# Altium schematic sheet DDS.SchDoc
size A2
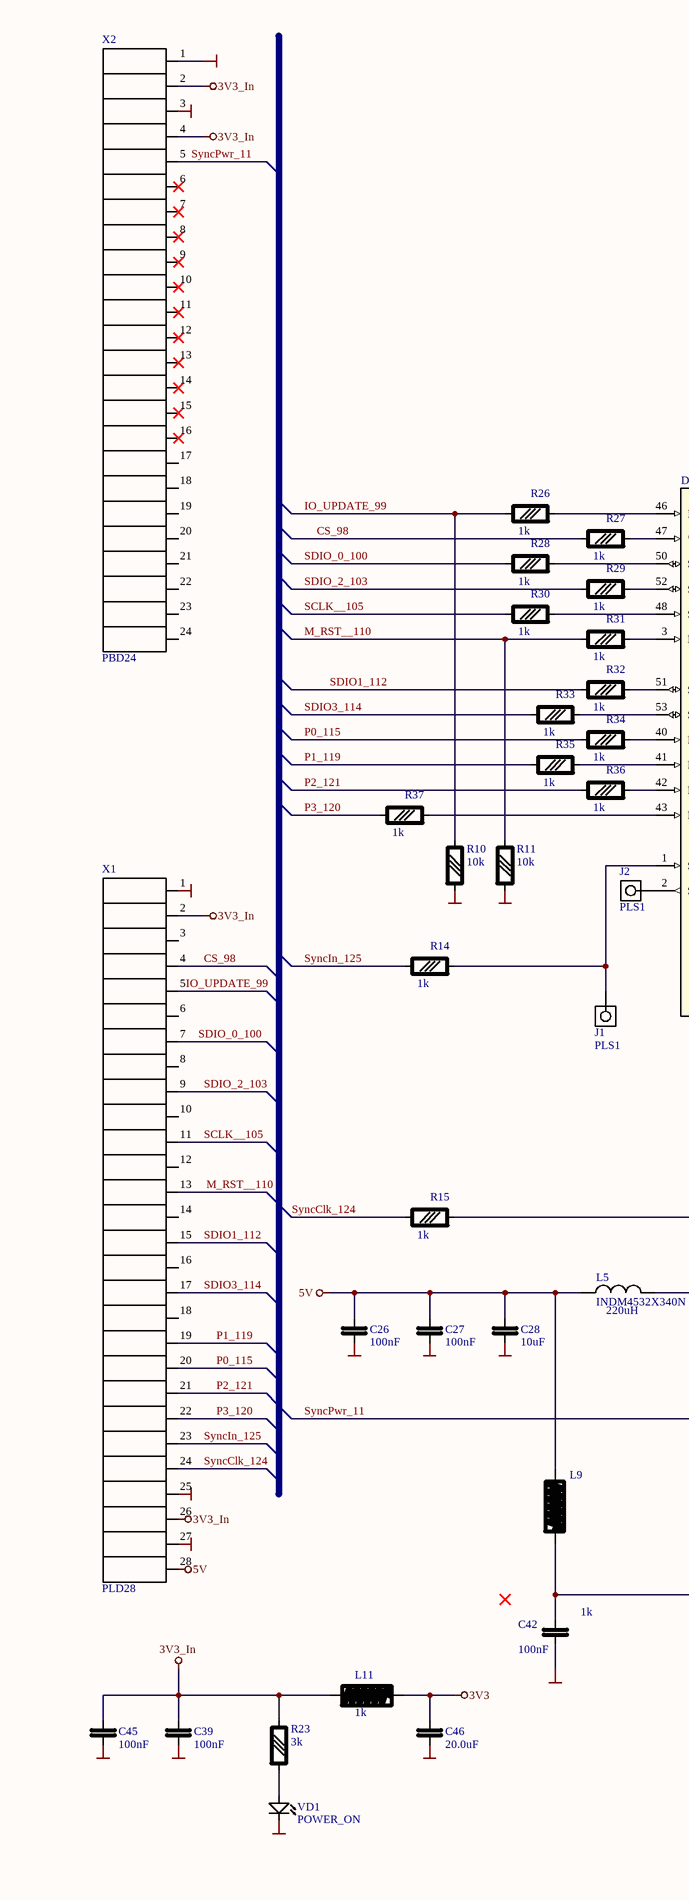
[diagram p0: DDS.SchDoc, left]
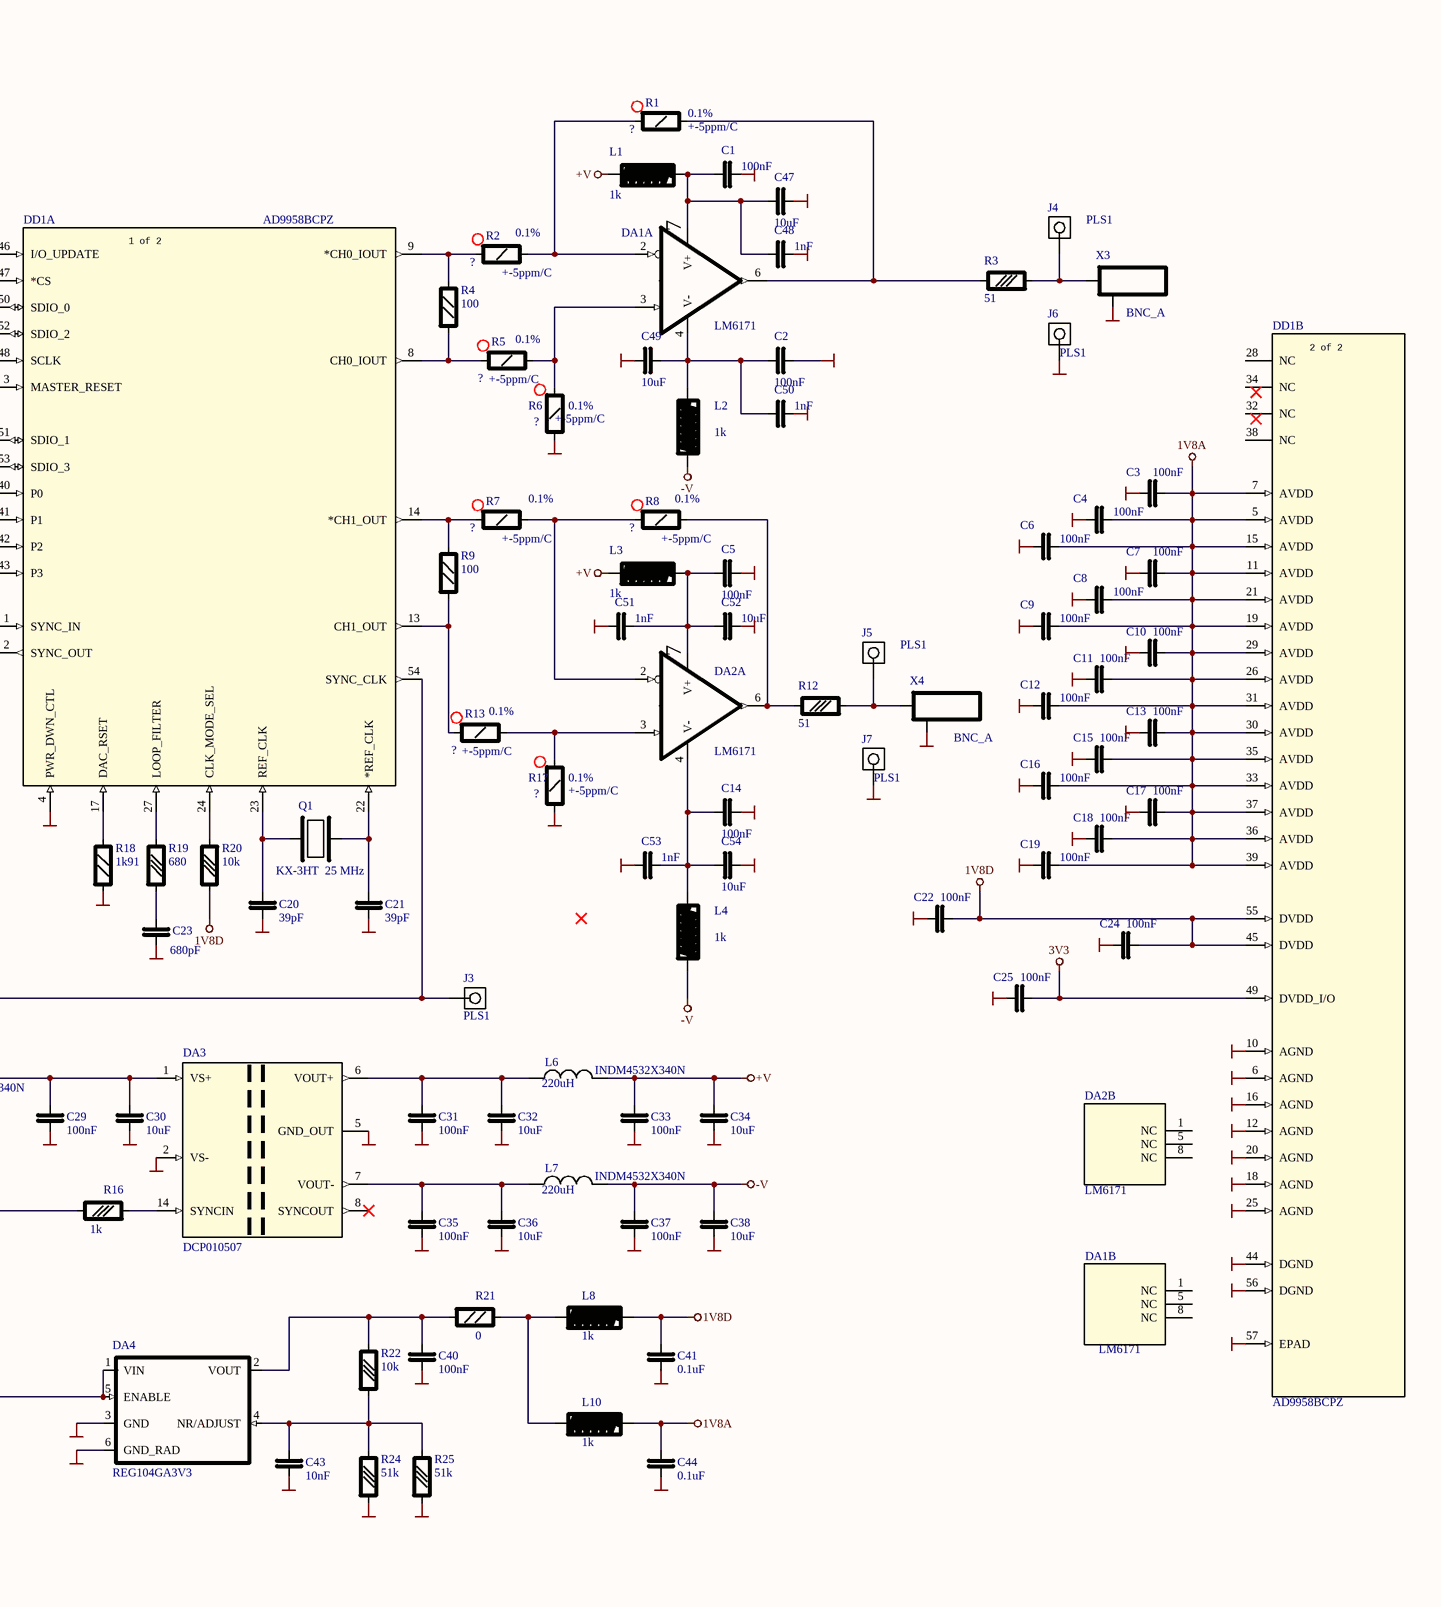
[diagram p1: DDS.SchDoc, right]

## Parts
C1  100nF  [CAPC1608X87N]
C2  100nF  [CAPC1608X87N]
C3  100nF  [CAPC1608X87N]
C4  100nF  [CAPC1608X87N]
C5  100nF  [CAPC1608X87N]
C6  100nF  [CAPC1608X87N]
C7  100nF  [CAPC1608X87N]
C8  100nF  [CAPC1608X87N]
C9  100nF  [CAPC1608X87N]
C10  100nF  [CAPC1608X87N]
C11  100nF  [CAPC1608X87N]
C12  100nF  [CAPC1608X87N]
C13  100nF  [CAPC1608X87N]
C14  100nF  [CAPC1608X87N]
C15  100nF  [CAPC1608X87N]
C16  100nF  [CAPC1608X87N]
C17  100nF  [CAPC1608X87N]
C18  100nF  [CAPC1608X87N]
C19  100nF  [CAPC1608X87N]
C20  39pF  [CAPC1608X87N]
C21  39pF  [CAPC1608X87N]
C22  100nF  [CAPC1608X87N]
C23  680pF  [CAPC1608X87N]
C24  100nF  [CAPC1608X87N]
C25  100nF  [CAPC1608X87N]
C26  100nF  [CAPC1608X87N]
C27  100nF  [CAPC1608X87N]
C28  10uF  [SMD0805CAP]
C29  100nF  [CAPC1608X87N]
C30  10uF  [SMD0805CAP]
C31  100nF  [CAPC1608X87N]
C32  10uF  [SMD0805CAP]
C33  100nF  [CAPC1608X87N]
C34  10uF  [SMD0805CAP]
C35  100nF  [CAPC1608X87N]
C36  10uF  [SMD0805CAP]
C37  100nF  [CAPC1608X87N]
C38  10uF  [SMD0805CAP]
C39  100nF  [CAPC1608X87N]
C40  100nF  [CAPC1608X87N]
C41  0.1uF  [SMD0805CAP]
C42  100nF  [CAPC1608X87N]
C43  10nF  [CAPC1608X87N]
C44  0.1uF  [SMD0805CAP]
C45  100nF  [CAPC1608X87N]
C46  20.0uF  [SMD0805CAP]
C47  10uF  [CAPC1206]
C48  1nF  [CAPC1608X87N]
C49  10uF  [CAPC1206]
C50  1nF  [CAPC1608X87N]
C51  1nF  [CAPC1608X87N]
C52  10uF  [CAPC1206]
C53  1nF  [CAPC1608X87N]
C54  10uF  [CAPC1206]
DA1  LM6171  [DIP8-300]  (parts A,B of 2)
DA2  LM6171  [DIP8-300]  (parts A,B of 2)
DA3  DCP010507  [NVA7]
DA4  REG104GA3V3  [SOT223_6-127]
DD1  AD9958BCPZ  [CP_56_1_ADI-M]  (parts A,B of 2)
J1  PLS1  [PLS1]
J2  PLS1  [PLS1]
J3  PLS1  [PLS1]
J4  PLS1  [PLS1]
J5  PLS1  [PLS1]
J6  PLS1  [PLS1]
J7  PLS1  [PLS1]
L1  1k  [RESC2012X50N]
L2  1k  [RESC2012X50N]
L3  1k  [RESC2012X50N]
L4  1k  [RESC2012X50N]
L5  INDM4532X340N  Inductance: 220uH  [INDM4532X340N]
L6  INDM4532X340N  Inductance: 220uH  [INDM4532X340N]
L7  INDM4532X340N  Inductance: 220uH  [INDM4532X340N]
L8  1k  [RESC2012X50N]
L9  1k  [RESC2012X50N]
L10  1k  [RESC2012X50N]
L11  1k  [RESC2012X50N]
Q1  KX-3HT  25 MHz  [HC49_S]
R1  ?  Tolerance: 0.1%  TC: +-5ppm/C  [RES_VISHAY_CMF60]
R2  ?  Tolerance: 0.1%  TC: +-5ppm/C  [RES_VISHAY_CMF60]
R3  51  [RESC1608X64N]
R4  100  [SMD0805RES]
R5  ?  Tolerance: 0.1%  TC: +-5ppm/C  [RES_VISHAY_CMF60]
R6  ?  Tolerance: 0.1%  TC: +-5ppm/C  [RES_VISHAY_CMF60]
R7  ?  Tolerance: 0.1%  TC: +-5ppm/C  [RES_VISHAY_CMF60]
R8  ?  Tolerance: 0.1%  TC: +-5ppm/C  [RES_VISHAY_CMF60]
R9  100  [SMD0805RES]
R10  10k  [RESC1608X64N]
R11  10k  [RESC1608X64N]
R12  51  [RESC1608X64N]
R13  ?  Tolerance: 0.1%  TC: +-5ppm/C  [RES_VISHAY_CMF60]
R14  1k  [RESC1608X64N]
R15  1k  [RESC1608X64N]
R16  1k  [RESC1608X64N]
R17  ?  Tolerance: 0.1%  TC: +-5ppm/C  [RES_VISHAY_CMF60]
R18  1k91  [SMD0805RES]
R19  680  [RESC1608X64N]
R20  10k  [RESC1608X64N]
R21  0  [SMD0805RES]
R22  10k  [RESC1608X64N]
R23  3k  [RESC1608X64N]
R24  51k  [RESC1608X64N]
R25  51k  [RESC1608X64N]
R26  1k  [RESC1608X64N]
R27  1k  [RESC1608X64N]
R28  1k  [RESC1608X64N]
R29  1k  [RESC1608X64N]
R30  1k  [RESC1608X64N]
R31  1k  [RESC1608X64N]
R32  1k  [RESC1608X64N]
R33  1k  [RESC1608X64N]
R34  1k  [RESC1608X64N]
R35  1k  [RESC1608X64N]
R36  1k  [RESC1608X64N]
R37  1k  [RESC1608X64N]
VD1  POWER_ON  [LED0603]
X1  PLD28  [PLD28]
X2  PBD24  [PBD24]
X3  BNC_A  [TYCO_1-1337542-0]
X4  BNC_A  [TYCO_1-1337542-0]

## Nets
1V8A: C3.1 C4.1 C6.1 C7.1 C8.1 C9.1 C10.1 C11.1 C12.1 C13.1 C15.1 C16.1 C17.1 C18.1 C19.1 C44.2 DD1.5(AVDD) DD1.7(AVDD) DD1.11(AVDD) DD1.15(AVDD) DD1.19(AVDD) DD1.21(AVDD) DD1.26(AVDD) DD1.29(AVDD) DD1.30(AVDD) DD1.31(AVDD) DD1.33(AVDD) DD1.35(AVDD) DD1.36(AVDD) DD1.37(AVDD) DD1.39(AVDD) L10.2
1V8D: C22.1 C24.1 C41.2 DD1.45(DVDD) DD1.55(DVDD) L8.2 R20.2
3V3: C25.1 C46.2 DD1.49(DVDD_I/O) L11.2
3V3_In: C39.2 C45.2 L11.1 R23.2 X1.2 X1.26 X2.2 X2.4
5V: C26.2 C27.2 C28.2 L5.1 L9.1 X1.28
+V: C33.2 C34.2 L1.1 L3.1 L6.2
-V: C37.2 C38.2 L2.1 L4.1 L7.2
GND: C1.1 C2.1 C3.2 C4.2 C5.1 C6.2 C7.2 C8.2 C9.2 C10.2 C11.2 C12.2 C13.2 C14.1 C15.2 C16.2 C17.2 C18.2 C19.2 C20.1 C21.1 C22.2 C23.1 C24.2 C25.2 C26.1 C27.1 C28.1 C29.1 C30.1 C31.1 C32.1 C33.1 C34.1 C35.1 C36.1 C37.1 C38.1 C39.1 C40.1 C41.1 C42.1 C43.1 C44.1 C45.1 C46.1 C47.1 C48.1 C49.1 C50.1 C51.2 C52.2 C53.2 C54.2 DA3.2(VS-) DA3.5(GND_OUT) DA4.3(GND) DA4.6(GND_RAD) DD1.4(PWR_DWN_CTL) DD1.6(AGND) DD1.10(AGND) DD1.12(AGND) DD1.16(AGND) DD1.18(AGND) DD1.20(AGND) DD1.25(AGND) DD1.44(DGND) DD1.56(DGND) DD1.57(EPAD) J6.1 J7.1 R6.2 R10.1 R11.1 R17.2 R18.1 R24.1 R25.1 VD1.1(Cathode) X1.1 X1.25 X1.27 X2.1 X2.3 X3.2 X4.2
CS_98: R27.2 X1.4
IO_UPDATE_99: R10.2 R26.2 X1.5
M_RST__110: R11.2 R31.2 X1.13
P0_115: R34.2 X1.20
P1_119: R35.2 X1.19
P2_121: R36.2 X1.21
P3_120: R37.2 X1.22
SCLK__105: R30.2 X1.11
SDIO1_112: R32.2 X1.15
SDIO3_114: R33.2 X1.17
SDIO_0_100: R28.2 X1.7
SDIO_2_103: R29.2 X1.9
SyncClk_124: R15.2 X1.24
SyncIn_125: R14.2 X1.23
SyncPwr_11: R16.2 X2.5
NetC1_2: C1.2 C47.2 C48.2 DA1.7(V+) L1.2
NetC2_2: C2.2 C49.2 C50.2 DA1.4(V-) L2.2
NetC5_2: C5.2 C51.1 C52.1 DA2.7(V+) L3.2
NetC14_2: C14.2 C53.1 C54.1 DA2.4(V-) L4.2
NetC20_2: C20.2 DD1.23(REF_CLK) Q1.2
NetC21_2: C21.2 DD1.22(*REF_CLK) Q1.1
NetC23_2: C23.2 R19.1
NetC29_2: C29.2 C30.2 DA3.1(VS+) L5.2
NetC31_2: C31.2 C32.2 DA3.6(VOUT+) L6.1
NetC35_2: C35.2 C36.2 DA3.7(VOUT-) L7.1
NetC40_2: C40.2 DA4.2(VOUT) R21.1 R22.2
NetC42_2: C42.2 DA4.1(VIN) DA4.5(ENABLE) L9.2
NetC43_2: C43.2 DA4.4(NR/ADJUST) R22.1 R24.2 R25.2
NetDA1_2: DA1.2(IN-) R1.1 R2.2
NetDA1_3: DA1.3(IN+) R5.2 R6.1
NetDA1_6: DA1.6(OUT) R1.2 R3.2
NetDA2_2: DA2.2(IN-) R7.2 R8.1
NetDA2_3: DA2.3(IN+) R13.2 R17.1
NetDA2_6: DA2.6(OUT) R8.2 R12.2
NetDA3_14: DA3.14(SYNCIN) R16.1
NetDD1_1: DD1.1(SYNC_IN) J1.1 R14.1
NetDD1_2: DD1.2(SYNC_OUT) J2.1
NetDD1_3: DD1.3(MASTER_RESET) R31.1
NetDD1_8: DD1.8(CH0_IOUT) R4.1 R5.1
NetDD1_9: DD1.9(*CH0_IOUT) R2.1 R4.2
NetDD1_13: DD1.13(CH1_OUT) R9.1 R13.1
NetDD1_14: DD1.14(*CH1_OUT) R7.1 R9.2
NetDD1_17: DD1.17(DAC_RSET) R18.2
NetDD1_24: DD1.24(CLK_MODE_SEL) R20.1
NetDD1_27: DD1.27(LOOP_FILTER) R19.2
NetDD1_40: DD1.40(P0) R34.1
NetDD1_41: DD1.41(P1) R35.1
NetDD1_42: DD1.42(P2) R36.1
NetDD1_43: DD1.43(P3) R37.1
NetDD1_46: DD1.46(I/O_UPDATE) R26.1
NetDD1_47: DD1.47(*CS) R27.1
NetDD1_48: DD1.48(SCLK) R30.1
NetDD1_50: DD1.50(SDIO_0) R28.1
NetDD1_51: DD1.51(SDIO_1) R32.1
NetDD1_52: DD1.52(SDIO_2) R29.1
NetDD1_53: DD1.53(SDIO_3) R33.1
NetDD1_54: DD1.54(SYNC_CLK) J3.1 R15.1
NetJ4_1: J4.1 R3.1 X3.1
NetJ5_1: J5.1 R12.1 X4.1
NetL8_1: L8.1 L10.1 R21.2
NetR23_1: R23.1 VD1.2(Anode)

Not connected (* = marked no-connect by the designer): DA1 1(NC) 5(NC) 8(NC); DA2 1(NC) 5(NC) 8(NC); DA3 8(SYNCOUT)*; DD1 28(NC) 32(NC) 34(NC) 38(NC); X1 3 6 8 10 12 14 16 18; X2 6* 7* 8* 9* 10* 11* 12* 13* 14* 15* 16* 17 18 19 20 21 22 23 24

## Notes on the sheet
- (in symbol AD9958BCPZ, part A) 1 of 2
- (in symbol AD9958BCPZ, part B) 2 of 2

## Library data of the parts
C1-C27 C29 C31 C33 C35 C37 C39 C40 C42 C43 C45 = C0603: Чип конденсатор 0603; Voltage: 50V; Vendor: Generic; DielectricType: Y5V; Tol: 20%; SolderOption: Norm; Price: 2
  C1-C19 C22 C24-C27 C29 C31 C33 C35 C37 C39 C40 C42 C45: Value: 100nF
  C20 C21: Value: 39pF
  C23: Value: 680pF
  C43: Value: 10nF
C28 C30 C32 C34 C36 C38 C41 C44 = C0805: Чип конденсатор 0805; Voltage: 50V; Vendor: Generic; DielectricType: Y5V; Tol: 20%; SolderOption: Norm; Price: 2
  C28 C30 C32 C34 C36 C38: Value: 10uF
  C41 C44: Value: 0.1uF
C46 = C0805: Чип конденсатор 0805; Voltage: 20V; Vendor: Generic; DielectricType: Y5V; Tol: 20%; SolderOption: Norm; Value: 20.0uF; Price: 2
C47 C49 C52 C54 = C1206: Чип конденсатор 0805; Voltage: 25V; Vendor: Generic; DielectricType: Y5V; Tol: 20%; SolderOpton: Norm; Value: 10uF; Price: 2; Parameter 1: *
C48 C50 C51 C53 = C0603: Чип конденсатор 0603; Voltage: 50V; Vendor: Generic; DielectricType: NP0; Tol: 20%; SolderOption: Norm; Value: 1nF; Price: 2
DA1 DA2 = LM6171: No Description Available; Manufacturer_Part_Number: LM6171BIN/NOPB; Manufacturer: Texas Instruments; Value: LM6171; PackageReference: P0008A; Parameter 1: *; MountType: SMT; Application_BuildNumber: *
DA3 = DCP010507: DC/DC 5V to isolated +-7V; Vendor: Texas Instruments; Copyright: Copyright (C) 2022 Ultra Librarian. All rights reserved.; Value: DCP010507; Price: 1000
DA4 = REG104GA: Positive LDO Linear stabilizer; Vendor: Texas Instruments; Value: 3V3; Device: REG104GA; Unit Price: 6; Package: SOT223-6
DD1 = AD9958BCPZ: 2х канальный   500 MSpS  DDS; SolderOption: DEV; Voltage: Core:1V8 IO:3V3; Vendor: Analog Devices Inc; Value: AD9958BCPZ; Price: 2500
J1-J7 = PLS1: Штырь PLS1; SolderOption: Norm; Price: 1; Vendor: *; Value: PLS1
L1-L4 L8-L11 = BLM21: SMD Ferrite bead 0805; Vendor: Vishay; Unit Price: 0.1; Device: BLM21; Package: SMD0805; Value: 1k
L5-L7 = INDM4532X340N: SMD Дроссель; Vendor: Sumida; Curent: 0.5A; Price: 100; Value: INDM4532X340N
Q1 = KX-3HT: Резонатор кварцевый; Vendor: Geyer; SolderOption: Norm; Price: 50; Value: KX-3HT  25 MHz
R1 R2 R5-R8 R13 R17 = S2-29: Чип резистор 1206; Vendor: Generic; SolderOpton: Norm; Price: 2; Value: ?
R3 R10-R12 R14-R16 R19 R20 R22-R37 = R0603: Чип резистор 0603; Vendor: Generic; Tolerance: 5%; TC: +-100ppm/C; SolderOption: Norm; Price: 2
  R3 R12: Value: 51
  R10 R11 R20 R22: Value: 10k
  R14-R16 R26-R37: Value: 1k
  R19: Value: 680
  R23: Value: 3k
  R24 R25: Value: 51k
R4 R9 R18 R21 = R0805: Чип резистор 0805; Vendor: Generic; Tolerance: 5%; SolderOpton: Norm; TC: +-100ppm/C; Price: 2
  R4 R9: Value: 100
  R18: Value: 1k91
  R21: Value: 0
VD1 = LED0603: Чип светодиод 0603; Vendor: KB; Color: Green; SolderOpton: Norm; Price: 20; Value: POWER_ON
X1 = PLD28: Вилка  PLD 28/2.54; Vendor: Confly; SolderOption: Norm; Price: 20; Value: PLD28
X2 = PBD24: Розетка  PBD 24/2.54; Vendor: Confly; SolderOption: Norm; Price: 20; Value: PBD24
X3 X4 = BNC_A: BNC розетка; Vendor: TYCO; SolderOption: Norm; Price: 500; Value: BNC_A; ConnectTo: *; PartNum: TYCO_1-1337542-0